# EAGLE schematic currentsensor (EAGLE 8.1.0)
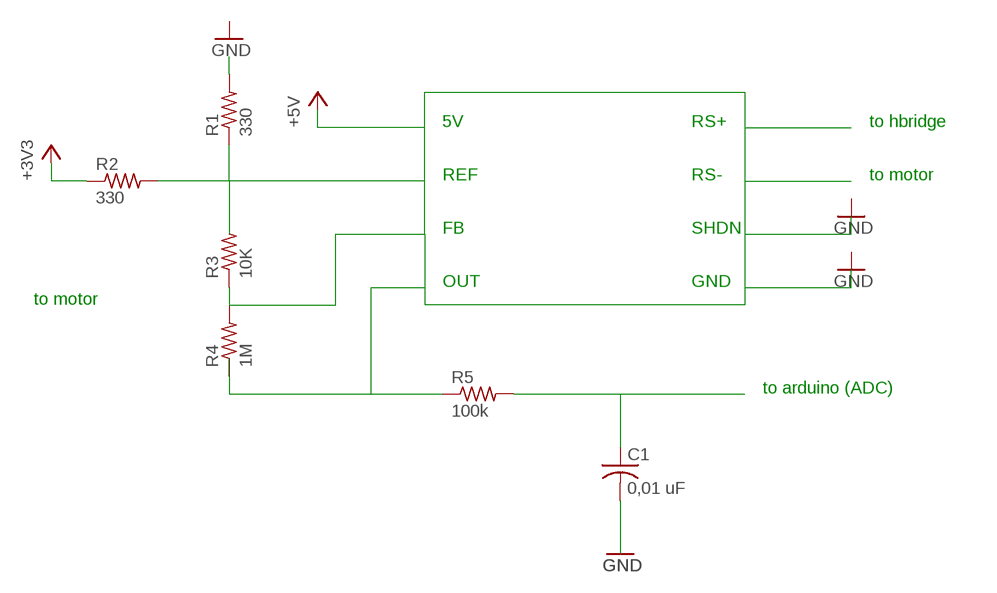
[diagram p0: schematic, sheet 1]

## Parts
C1  0,01 uF  C-US025-030X050  [C025-030X050]
R1  330  R-US_0207/5V  [0207/5V]
R2  330  R-US_0207/5V  [0207/5V]
R3  10K  R-US_0207/5V  [0207/5V]
R4  1M  R-US_0207/5V  [0207/5V]
R5  100k  R-US_0207/5V  [0207/5V]

## Nets
+3V3: R2.1
+5V: R1.1 R2.2 R3.1 R4.2 R5.1
N$1: R1.2
N$2: C1.1 R5.2
N$3: C1.2
Unconnected: R3.2 R4.1

## Notes on the sheet
- 5V | RS+ | to hbridge
- REF | RS- | to motor
- FB | SHDN
- OUT | GND
- to motor
- to arduino (ADC)

## Library data of the parts
C1 = resistor:C-US: CAPACITOR, American symbol
R1-R5 = resistor:R-US_: RESISTOR, American symbol